# Altium schematic sheet SD_LAN.SchDoc
size B; SheetNumber: 1; SheetTotal: 12
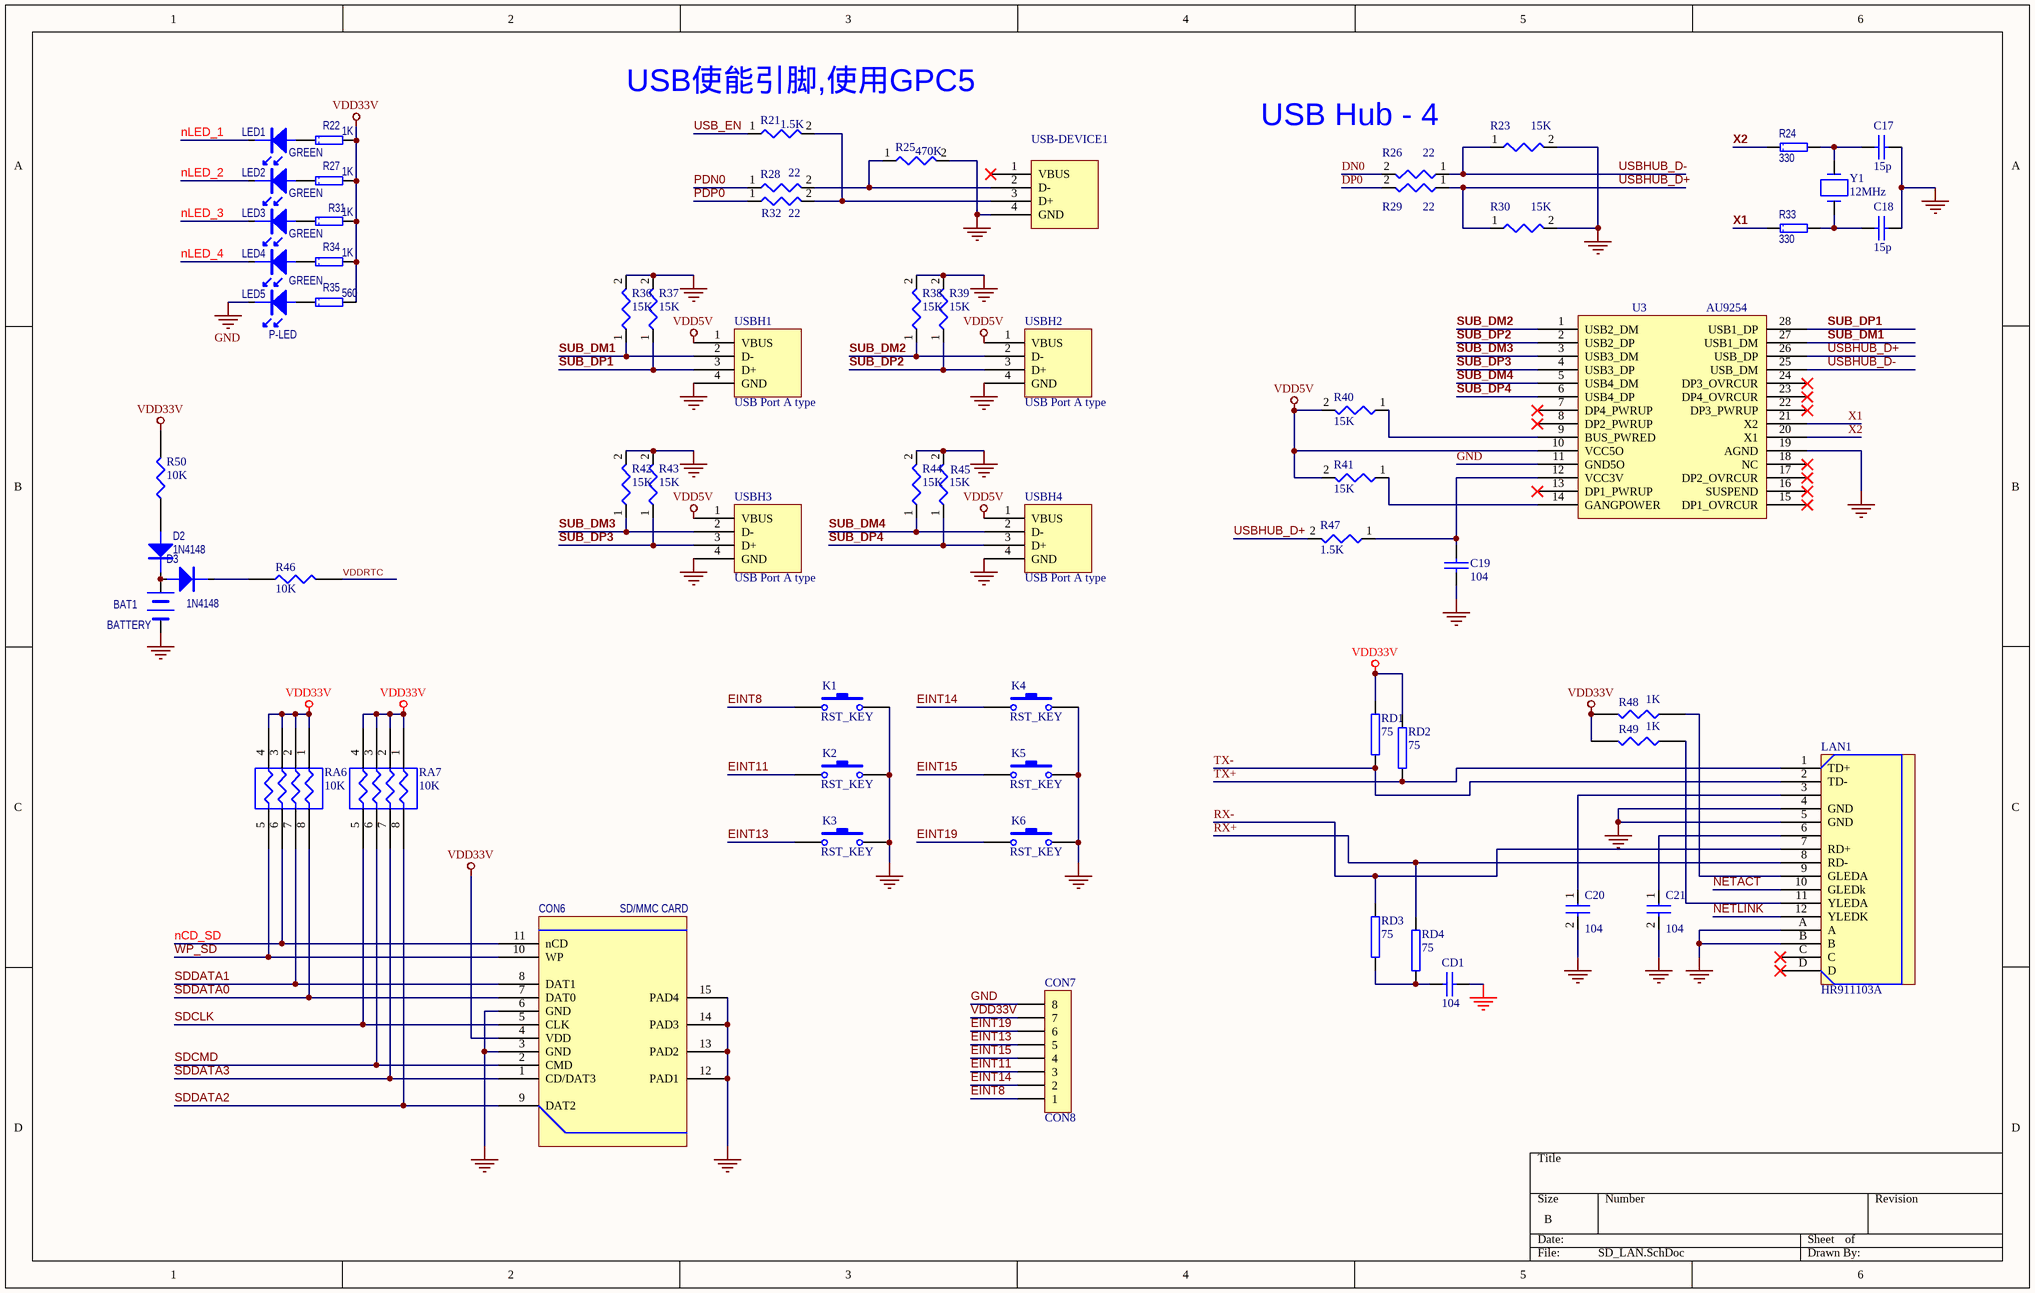
[diagram p0: SD_LAN.SchDoc]

## Parts
BAT1  BATTERY  [BATT]
C17  15p  [0603A]
C18  15p  [0603A]
C19  104  [0603A]
C20  104  [0603A]
C21  104  [0603A]
CD1  104  [0603A]
CON6  SD/MMC CARD  [SDCARD]
CON7  CON8  [SMD8]
D2  1N4148  [D1206]
D3  1N4148  [D1206]
K1  RST_KEY  [SW-PB2]
K2  RST_KEY  [SW-PB2]
K3  RST_KEY  [SW-PB2]
K4  RST_KEY  [SW-PB2]
K5  RST_KEY  [SW-PB2]
K6  RST_KEY  [SW-PB2]
LAN1  HR911103A  [HR911103A]
LED1  GREEN  [LED]
LED2  GREEN  [LED]
LED3  GREEN  [LED]
LED4  GREEN  [LED]
LED5  P-LED  [LED]
R21  1.5K  [0603R]
R22  1K  [0603R]
R23  15K  [0603R]
R24  330  [0603R]
R25  470K  [0603R]
R26  22  [0603R]
R27  1K  [0603R]
R28  22  [0603R]
R29  22  [0603R]
R30  15K  [0603R]
R31  1K  [0603R]
R32  22  [0603R]
R33  330  [0603R]
R34  1K  [0603R]
R35  560  [0603R]
R36  15K  [0603R]
R37  15K  [0603R]
R38  15K  [0603R]
R39  15K  [0603R]
R40  15K  [0603R]
R41  15K  [0603R]
R42  15K  [0603R]
R43  15K  [0603R]
R44  15K  [0603R]
R45  15K  [0603R]
R46  10K  [0603R]
R47  1.5K  [0603R]
R48  1K  [0603R]
R49  1K  [0603R]
R50  10K  [0603R]
RA6  10K  [R-AR4]
RA7  10K  [R-AR4]
RD1  75  [0603R]
RD2  75  [0603R]
RD3  75  [0603R]
RD4  75  [0603R]
U3  AU9254  [AU9254]
USB-DEVICE1  USB Port A type  [USB-B]  (value not drawn)
USBH1  USB Port A type  [USB-A]
USBH2  USB Port A type  [USB-A]
USBH3  USB Port A type  [USB-A]
USBH4  USB Port A type  [USB-A]
Y1  12MHz  [OSC2PR-1]

## Nets
GND: BAT1.2 C17.1 C18.1 C19.1 C20.2 C21.2 CD1.2 CON6.3(GND) CON6.6(GND) CON6.12(PAD1) CON6.13(PAD2) CON6.14(PAD3) CON6.15(PAD4) CON7.8 K1.2 K2.2 K3.2 K4.2 K5.2 K6.2 LAN1.4(GND) LAN1.5(GND) LAN1.A LAN1.B LED5.2 R23.2 R25.2 R30.2 R36.2 R37.2 R38.2 R39.2 R42.2 R43.2 R44.2 R45.2 U3.11(GND5O) U3.19(AGND) USB-DEVICE1.4(GND) USBH1.4(GND) USBH2.4(GND) USBH3.4(GND) USBH4.4(GND)
VDD5V: R40.2 R41.2 U3.10(VCC5O) USBH1.1(VBUS) USBH2.1(VBUS) USBH3.1(VBUS) USBH4.1(VBUS)
VDD33V: CON6.4(VDD) CON7.7 R22.2 R27.2 R31.2 R34.2 R35.2 R48.2 R49.2 R50.2 RA6.1(R1) RA6.2(R2) RA6.3(R3) RA6.4(R4) RA7.1(R1) RA7.2(R2) RA7.3(R3) RA7.4(R4) RD1.2 RD2.2
DN0: R26.2
DP0: R29.2
EINT8: CON7.1 K1.1
EINT11: CON7.3 K2.1
EINT13: CON7.5 K3.1
EINT14: CON7.2 K4.1
EINT15: CON7.4 K5.1
EINT19: CON7.6 K6.1
nCD_SD: CON6.11(nCD) RA6.6(R3)
NETACT: LAN1.10(GLEDk)
NETLINK: LAN1.12(YLEDK)
nLED_1: LED1.2
nLED_2: LED2.2
nLED_3: LED3.2
nLED_4: LED4.2
PDN0: R28.1
PDP0: R32.1
RX+: LAN1.8(RD-) RD4.2
RX-: LAN1.7(RD+) RD3.2
SDCLK: CON6.5(CLK) RA7.5(R4)
SDCMD: CON6.2(CMD) RA7.6(R3)
SDDATA0: CON6.7(DAT0) RA6.8(R1)
SDDATA1: CON6.8(DAT1) RA6.7(R2)
SDDATA2: CON6.9(DAT2) RA7.8(R1)
SDDATA3: CON6.1(CD/DAT3) RA7.7(R2)
SUB_DM1: R36.1 U3.27(USB1_DM) USBH1.2(D-)
SUB_DM2: R38.1 U3.1(USB2_DM) USBH2.2(D-)
SUB_DM3: R42.1 U3.3(USB3_DM) USBH3.2(D-)
SUB_DM4: R44.1 U3.5(USB4_DM) USBH4.2(D-)
SUB_DP1: R37.1 U3.28(USB1_DP) USBH1.3(D+)
SUB_DP2: R39.1 U3.2(USB2_DP) USBH2.3(D+)
SUB_DP3: R43.1 U3.4(USB3_DP) USBH3.3(D+)
SUB_DP4: R45.1 U3.6(USB4_DP) USBH4.3(D+)
TX+: LAN1.1(TD+) RD2.1
TX-: LAN1.2(TD-) RD1.1
USB_EN: R21.1
USBHUB_D+: R29.1 R30.1 R47.2 U3.26(USB_DP)
USBHUB_D-: R23.1 R26.1 U3.25(USB_DM)
VDDRTC: R46.2
WP_SD: CON6.10(WP) RA6.5(R4)
X1: R33.1 U3.21(X2)
X2: R24.1 U3.20(X1)
NetBAT1_1: BAT1.1 D2.2 D3.1
NetC17_2: C17.2 R24.2 Y1.1
NetC18_2: C18.2 R33.2 Y1.2
NetC19_2: C19.2 R47.1 U3.12(VCC3V)
NetC20_1: C20.1 LAN1.3
NetC21_1: C21.1 LAN1.6
NetCD1_1: CD1.1 RD3.1 RD4.1
NetD2_1: D2.1 R50.1
NetD3_2: D3.2 R46.1
NetLAN1_9: LAN1.9(GLEDA) R48.1
NetLAN1_11: LAN1.11(YLEDA) R49.1
NetLED1_1: LED1.1 R22.1
NetLED2_1: LED2.1 R27.1
NetLED3_1: LED3.1 R31.1
NetLED4_1: LED4.1 R34.1
NetLED5_1: LED5.1 R35.1
NetR21_2: R21.2 R32.2 USB-DEVICE1.3(D+)
NetR25_1: R25.1 R28.2 USB-DEVICE1.2(D-)
NetR40_1: R40.1 U3.9(BUS_PWRED)
NetR41_1: R41.1 U3.14(GANGPOWER)

Not connected (* = marked no-connect by the designer): LAN1 C* D*; U3 7(DP4_PWRUP)* 8(DP2_PWRUP)* 13(DP1_PWRUP)* 15(DP1_OVRCUR)* 16(SUSPEND)* 17(DP2_OVRCUR)* 18(NC)* 22(DP3_PWRUP)* 23(DP4_OVRCUR)* 24(DP3_OVRCUR)*; USB-DEVICE1 1(VBUS)*

## Notes on the sheet
- (near R21) USB使能引脚,使用GPC5
- USB Hub - 4

## Library data of the parts
C17-C19 CD1 = CAP
C20 C21 = CAP NP_0: Text Field1: 20; Text Field2: 10
CON6 = SD
CON7 = CON8: Connector
D2 D3 = DIODE
K1-K6 = SW-PB: Switch; Published: 24-Mar-1999; LatestRevisionDate: 17-Jul-2002; LatestRevisionNote: Re-released for DXP Platform.; PackageReference: SPST-2; Publisher: Altium Limited
LED1-LED5 = LED
R21 R23 R25 R26 R28-R30 R32 R36-R45 R47 = RESISTOR_2: Text Field1: 20; Text Field2: 30
R22 R24 R27 R31 R33-R35 = RES
R46 R48-R50 = RES1
RA6 RA7 = RP4R: Text Field1: 30; Text Field2: 50
RD1-RD4 = RES2
U3 = USBHUB
USB-DEVICE1 USBH1-USBH4 = USBPORT: Text Field1: 50; Text Field2: 50
Y1 = CRYSTAL: Text Field1: 20; Text Field2: 20